# Altium project Glowna_plytka.PrjPcb
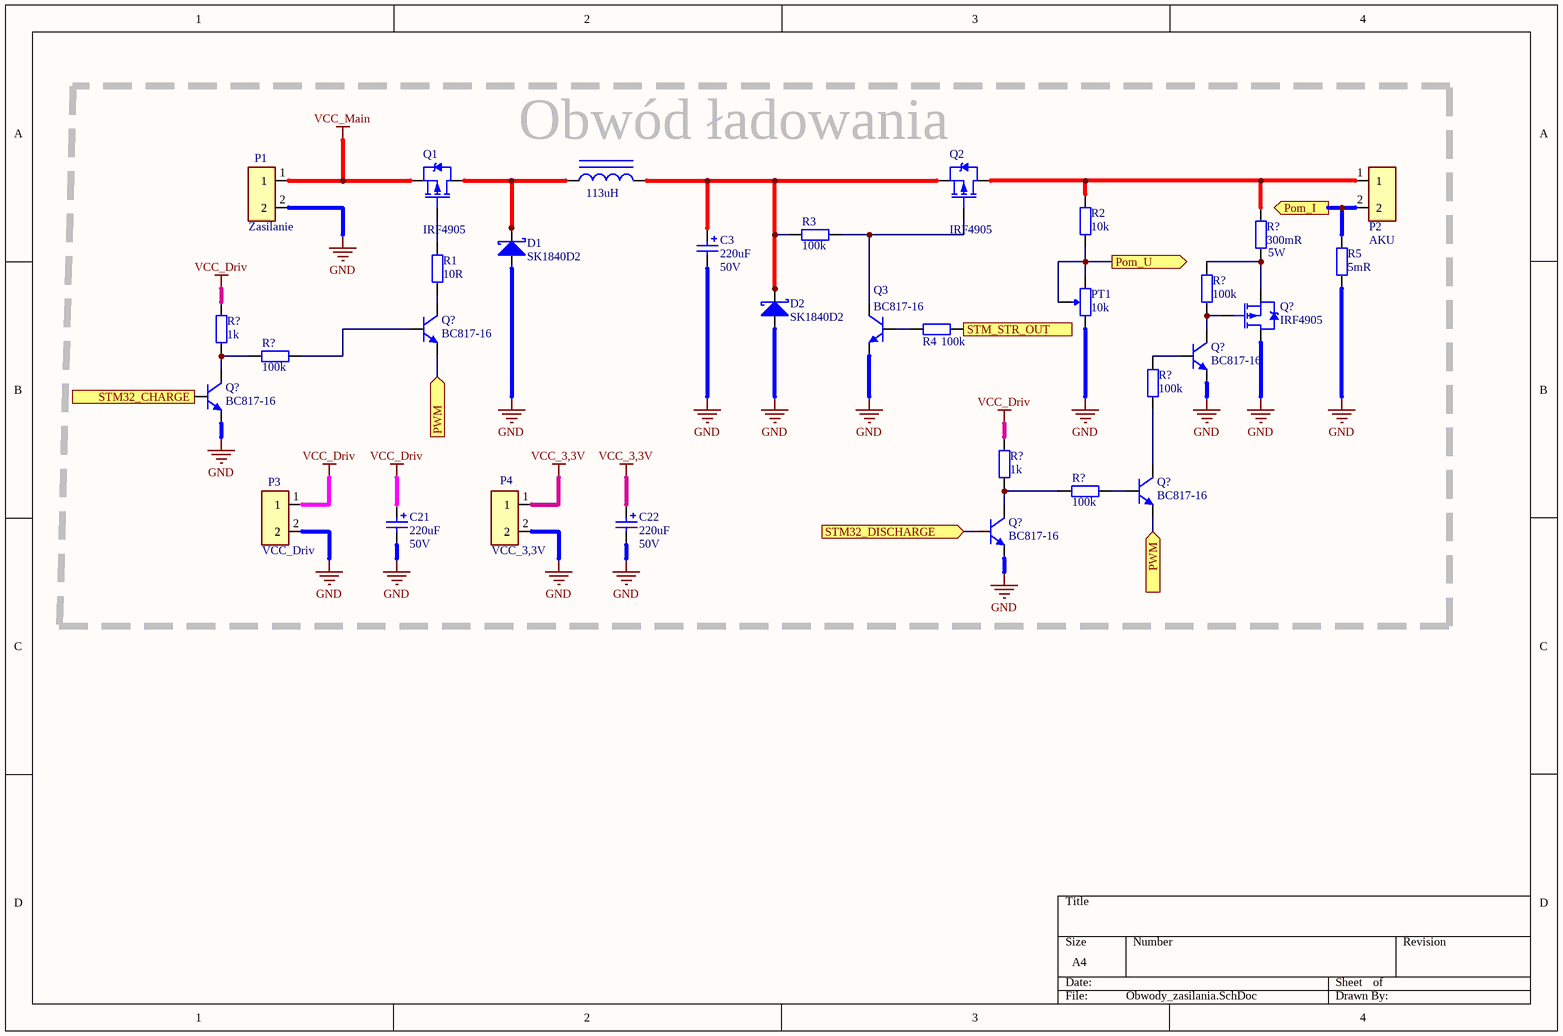
[diagram p0: Obwody_zasilania.SchDoc]
3 sheets, 82 parts. Net scope: flat (ports and power ports of the same name join across sheets).
Board file: Glowna_plytka.PcbDoc
Sheets:
  Obwody_zasilania.SchDoc
  Obwod_sterowania_MOSFET.SchDoc
  OBwod_sterowania_STM32.SchDoc

## Sheet Obwody_zasilania.SchDoc
size A4

### Parts
(Parts that share a designator on the sheet are numbered #1, #2 ... from top to bottom, then left to right.)
C3  Parametr_1: 220uF  Parametr_2: 50V  [C_POL_D10x16]  (hidden comment: Kondesator elektrolityczny)
C21  Parametr_1: 220uF  Parametr_2: 50V  [C_POL_D8x11,5]  (hidden comment: Kondesator elektrolityczny)
C22  Parametr_1: 220uF  Parametr_2: 50V  [C_POL_D10x16]  (hidden comment: Kondesator elektrolityczny)
D1  SK1840D2  [D2PAK]
D2  SK1840D2  [D2PAK]
L1  Parametr_1: 113uH  [L-EXX/XX/X]  (hidden comment: Inductor Iron)
P1  Oznaczenie: Zasilanie  [ARK2-5mm]  (hidden comment: Złacze śrubowe)
P2  Oznaczenie: AKU  [ARK2-5mm]  (hidden comment: Złacze śrubowe)
P3  Oznaczenie: VCC_Driv  [ARK2-5mm]  (hidden comment: Złacze śrubowe)
P4  Oznaczenie: VCC_3,3V  [ARK2-5mm]  (hidden comment: Złacze śrubowe)
PT1  Parametr_1: 10k  [Potecjomert]  (hidden comment: Potentiometer)
Q1  IRF4905  [D2PAK]
Q2  IRF4905  [D2PAK]
Q3  BC817-16  [SOT323]
Q?#1  BC817-16  [SOT323]
Q?#2  IRF4905  [D2PAK]
Q?#3  BC817-16  [SOT323]
Q?#4  BC817-16  [SOT323]
Q?#5  BC817-16  [SOT323]
Q?#6  BC817-16  [SOT323]
R1  Parametr_1: 10R  [SMD-1206-RES]  (hidden comment: Rezystor)
R2  Parametr_1: 10k  [SMD-1206-RES]  (hidden comment: Rezystor)
R3  Parametr_1: 100k  [SMD-1206-RES]  (hidden comment: Rezystor)
R4  Parametr_1: 100k  [SMD-1206-RES]  (hidden comment: Rezystor)
R5  Parametr_1: 5mR  [SMD-2512-RES]  (hidden comment: Rezystor)
R?#1  Parametr_2: 5W  Parametr_1: 300mR  [SMD-1206-RES]  (hidden comment: Rezystor)
R?#2  Parametr_1: 100k  [SMD-1206-RES]  (hidden comment: Rezystor)
R?#3  Parametr_1: 1k  [SMD-1206-RES]  (hidden comment: Rezystor)
R?#4  Parametr_1: 100k  [SMD-1206-RES]  (hidden comment: Rezystor)
R?#5  Parametr_1: 100k  [SMD-1206-RES]  (hidden comment: Rezystor)
R?#6  Parametr_1: 1k  [SMD-1206-RES]  (hidden comment: Rezystor)
R?#7  Parametr_1: 100k  [SMD-1206-RES]  (hidden comment: Rezystor)

### Blocks framed on the sheet
Obwód ładowania: C3 C21 C22 D1 D2 L1 P1-P4 PT1 Q1-Q3 Q?#1-Q?#6 R1-R5 R?#1-R?#7

### Ports
Pom_I (out), Pom_U (out), PWM (in), STM32_CHARGE (in), STM32_DISCHARGE (in), STM_STR_OUT (in)

### Nets
GND: C3.1 C21.1 C22.1 D1.3(A) D2.3(A) P1.2 P3.2 P4.2 PT1.3(BOT) Q3.2(E) Q?#2.2(D) Q?#3.2(E) Q?#4.2(E) Q?#6.2(E) R5.1
VCC_3,3V: C22.2 P4.1
VCC_Driv: C21.2 P3.1 R?#3.2 R?#6.2
VCC_Main: P1.1 Q1.3(S)
NetC3_2: C3.2 D2.1(K) D2.4(A) L1.5 Q2.3(S) R3.2
NetC23_2: P2.2 R5.2 ; port Pom_I
NetC24_2: PT1.1(TOP) PT1.2(TAP) R2.2 ; port Pom_U
NetD1_1: D1.1(K) D1.4(A) L1.1 Q1.2(D)
NetP2_1: P2.1 Q2.2(D) R2.1 R?#1.1
NetQ1_1: Q1.1(G) R1.2
NetQ2_1: Q2.1(G) Q3.3(C) R3.1
NetQ3_1: Q3.1(B) R4.2
NetQ?#1_1: Q?#1.1(B) R?#4.2
NetQ?#1_2: Q?#1.2(E) Q?#5.2(E) ; port PWM
NetQ?#1_3: Q?#1.3(C) R1.1
NetQ?#2_1: Q?#2.1(G) Q?#3.3(C) R?#2.2
NetQ?#2_3: Q?#2.3(S) R?#1.2 R?#2.1
NetQ?#3_1: Q?#3.1(B) R?#5.2
NetQ?#4_1: Q?#4.1(B) ; port STM32_CHARGE
NetQ?#4_3: Q?#4.3(C) R?#3.1 R?#4.1
NetQ?#5_1: Q?#5.1(B) R?#7.2
NetQ?#5_3: Q?#5.3(C) R?#5.1
NetQ?#6_1: Q?#6.1(B) ; port STM32_DISCHARGE
NetQ?#6_3: Q?#6.3(C) R?#6.1 R?#7.1
NetR4_1: R4.1 ; port STM_STR_OUT

### Library data of the parts
C3 C21 C22 = Kondesator elektrolityczny: Dostawca: TME; Montaż: THT; Obudowa: D10x16; Parametr_3: Tolerancja:; Parametr_4: Czas życzia:; Parametr_5: Temperatura pracy:; Nazwa: Kondesator elektrolityczny
  C3: Kod TME: ECA1EHG101
  C21 C22: Kod TME: JRG-220U/25
D1 D2 = SK1840D2: Dioda Schottky; Dostawca: TME; Montaż: SMD; Parametr_1: Prąd: 18A; Parametr_2: Max prąd imp.: 280A; Parametr_3: Max nap. wsteczne: 40V; Producent: DIOTEC SEMICONDUCTOR; Nazwa: Dioda Schottky; Obudowa: D2PAK; Oznaczenie: SK1840D2; Kod TME: SK1840D2-DIO
L1 = Inductor Iron: Magnetic-Core Inductor; Parametr_2: Ilość zwoji:; Parametr_3: Średnica drutu:; Revision: July-2002: Re-released for DXP Platform.
P1-P4 = Złacze śrubowe: Dostawca: TME; Montaż: THT; Nazwa: Listwa zaciskowa do druku, XY301V-2P; Parametr_1: 250VDC/AC; Parametr_2: 24A; Parametr_3: 2,5mm2; Producent: DEGSON ELECTRONICS; Kod TME: DG300-5.0-2P12
PT1 = Potentiometer: Potentiometer montażowy wielobortowy; Parametr_2: Moc:; Parametr_3: Tolerancja:; Parametr_4: Charakterystyka:; Parametr_5: Temperatura pracy:; Parametr_6: Max nap. pracy:; Nazwa: Potentiometer montażowy wielobortowy
Q1 Q2 Q?#2 = IRF4905: Traznystor MOSFET-P; Nazwa: Tranzystor MOSFET-P; Parametr_1: Prąd drenu: -74A; Parametr_2: Nap. dren-żródło: -55V; Parametr_3: Nap. bramka-żródło: -/+20V; Parametr_4: Rezystacja w stanie przewodzenia: 20mOhm; Parametr_6: Moc rozpraszana: 200W; Oznaczenie: IRF4905
Q3 Q?#1 Q?#3-Q?#6 = BC817-16: Tranzystor bipolarny PNP; Dostawca: TME; Montaż: SMD; Producent: DIOTEC SEMICONDUCTOR; Parametr_3: Npa. C-E: 45V; Parametr_4: Wzmocnienie: 100-250; Parametr_5: Częstotliwość: 100Mhz; Parametr_2: Prąd kolektora: 0,8A; Nazwa: Tranzystor bipolarny PNP; Obudowa: SOT323; Oznaczenie: BC817-16; Kod TME: BC817-16-DIO
R1-R4 R?#2-R?#7 = Rezystor: Dostawca: TME; Montaż: SMD; Obudowa: 1206; Parametr_2: Moc: 0,250W; Parametr_3: Tolerancja: 5%; Parametr_4: Max nap. pracy:; Parametr_5: Max nap impulsowe:; Nazwa: Rezystor
  R1: Kod TME: AC1206FR-0710RL
  R2-R4 R?#2-R?#7: Kod TME: SMD1206-100K
R5 = Rezystor: Dostawca: TME; Montaż: SMD; Obudowa: 2512; Parametr_2: Moc: 1W; Parametr_3: Tolerancja: 1%; Parametr_4: Max nap. pracy:; Parametr_5: Max nap impulsowe:; Nazwa: Rezystor; Kod TME: WW12RR005FTL
R?#1 = Rezystor: Dostawca: TME; Montaż: SMD; Obudowa: 1206; Parametr_3: Tolerancja: 5%; Parametr_4: Max nap. pracy:; Parametr_5: Max nap impulsowe:; Nazwa: Rezystor; Kod TME: SMD1206-100K

## Sheet Obwod_sterowania_MOSFET.SchDoc
size A4
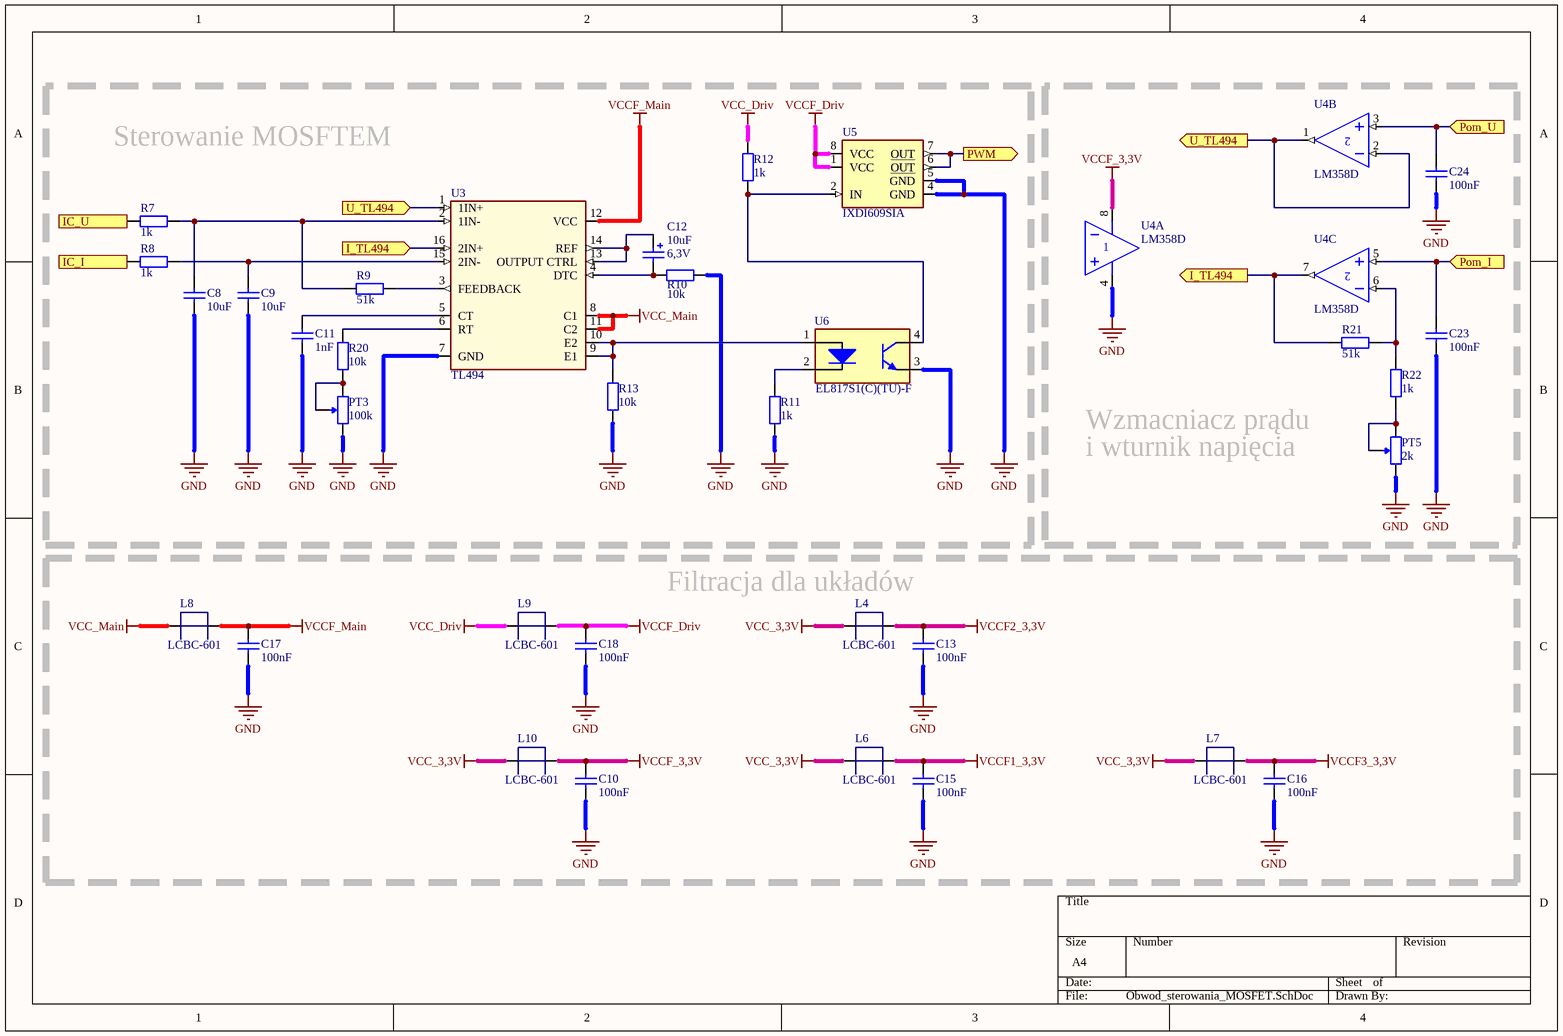
[diagram p1: Obwod_sterowania_MOSFET.SchDoc]

### Parts
C8  Parametr_1: 10uF  [SMD-1206C]  (hidden comment: Kondesator)
C9  Parametr_1: 10uF  [SMD-1206C]  (hidden comment: Kondesator)
C10  Parametr_1: 100nF  [SMD-1206C]  (hidden comment: Kondesator)
C11  Parametr_1: 1nF  [SMD-1206C]  (hidden comment: Kondesator)
C12  Parametr_1: 10uF  Parametr_2: 6,3V  [SMD-1206C]  (hidden comment: Kondesator elektrolityczny)
C13  Parametr_1: 100nF  [SMD-1206C]  (hidden comment: Kondesator)
C15  Parametr_1: 100nF  [SMD-1206C]  (hidden comment: Kondesator)
C16  Parametr_1: 100nF  [SMD-1206C]  (hidden comment: Kondesator)
C17  Parametr_1: 100nF  [SMD-1206C]  (hidden comment: Kondesator)
C18  Parametr_1: 100nF  [SMD-1206C]  (hidden comment: Kondesator)
C23  Parametr_1: 100nF  [SMD-1206C]  (hidden comment: Kondesator)
C24  Parametr_1: 100nF  [SMD-1206C]  (hidden comment: Kondesator)
L4  Oznaczenie: LCBC-601  [SMD-1206-RES]
L6  Oznaczenie: LCBC-601  [SMD-1206-RES]
L7  Oznaczenie: LCBC-601  [SMD-1206-RES]
L8  Oznaczenie: LCBC-601  [SMD-1206-RES]
L9  Oznaczenie: LCBC-601  [SMD-1206-RES]
L10  Oznaczenie: LCBC-601  [SMD-1206-RES]
PT3  Parametr_1: 100k  [Potecjomert]  (hidden comment: Potentiometer)
PT5  Parametr_1: 2k  [Potecjomert]  (hidden comment: Potentiometer)
R7  Parametr_1: 1k  [SMD-1206-RES]  (hidden comment: Rezystor)
R8  Parametr_1: 1k  [SMD-1206-RES]  (hidden comment: Rezystor)
R9  Parametr_1: 51k  [SMD-1206-RES]  (hidden comment: Rezystor)
R10  Parametr_1: 10k  [SMD-1206-RES]  (hidden comment: Rezystor)
R11  Parametr_1: 1k  [SMD-1206-RES]  (hidden comment: Rezystor)
R12  Parametr_1: 1k  [SMD-1206-RES]  (hidden comment: Rezystor)
R13  Parametr_1: 10k  [SMD-1206-RES]  (hidden comment: Rezystor)
R20  Parametr_1: 10k  [SMD-1206-RES]  (hidden comment: Rezystor)
R21  Parametr_1: 51k  [SMD-1206-RES]  (hidden comment: Rezystor)
R22  Parametr_1: 1k  [SMD-1206-RES]  (hidden comment: Rezystor)
U3  TL494  [SOP16]
U4  LM358D  [SOIC8]  (parts A,B,C of 3)
U5  IXDI609SIA  [SO8]
U6  Transoptor  [S1]  (value not drawn)

### Blocks framed on the sheet
Sterowanie MOSFTEM: C8 C9 C11 C12 PT3 R7-R13 R20 U3 U5 U6

### Ports
I_TL494 (in), I_TL494 (out), IC_I (in), IC_U (in), Pom_I (in), Pom_U (in), PWM (out), U_TL494 (in), U_TL494 (out)

### Nets
GND: C8.1 C9.1 C10.1 C11.1 C13.1 C15.1 C16.1 C17.1 C18.1 C23.1 C24.1 PT3.3(BOT) PT5.3(BOT) R10.2 R11.1 R13.1 U3.7(GND) U4.4(V-) U5.4(GND) U5.5(GND) U6.3
VCC_3,3V: L4.1 L6.1 L7.1 L10.1
VCC_Driv: L9.1 R12.2
VCC_Main: L8.1 U3.8(C1) U3.11(C2)
VCCF1_3,3V: C15.2 L6.2
VCCF2_3,3V: C13.2 L4.2
VCCF3_3,3V: C16.2 L7.2
VCCF_3,3V: C10.2 L10.2 U4.8(V+)
VCCF_Driv: C18.2 L9.2 U5.1(VCC) U5.8(VCC)
VCCF_Main: C17.2 L8.2 U3.12(VCC)
NetC8_2: C8.2 R7.2 R9.2 U3.2(1IN-)
NetC9_2: C9.2 R8.2 U3.15(2IN-)
NetC11_2: C11.2 U3.5(CT)
NetC12_1: C12.1 R10.1 U3.4(DTC)
NetC12_2: C12.2 U3.13(OUTPUT_CTRL) U3.14(REF)
NetC23_2: C23.2 U4.5(IN+) ; port Pom_I
NetC24_2: C24.2 U4.3(IN+) ; port Pom_U
NetPT3_1: PT3.1(TOP) PT3.2(TAP) R20.2
NetPT5_1: PT5.1(TOP) PT5.2(TAP) R22.2
NetQ?#1_2: U5.6(OUT) U5.7(OUT) ; port PWM
NetR7_1: R7.1 ; port IC_U
NetR8_1: R8.1 ; port IC_I
NetR9_1: R9.1 U3.3(FEEDBACK)
NetR11_2: R11.2 U6.2
NetR12_1: R12.1 U5.2(IN) U6.4
NetR13_2: R13.2 U3.9(E1) U3.10(E2) U6.1
NetR20_1: R20.1 U3.6(RT)
NetR21_1: R21.1 R22.1 U4.6(IN-)
NetR21_2: R21.2 U3.16(2IN+) U4.7(OUT) ; port I_TL494
NetU1_6: U3.1(1IN+) U4.1(OUT) U4.2(IN-) ; port U_TL494

### Notes on the sheet
- Wzmacniacz prądu
- (near PT5) i wturnik napięcia
- Filtracja dla układów

### Library data of the parts
C8-C11 C13 C15-C18 C23 C24 = Kondesator: Dostawca: TME; Montaż: SMD; Obudowa: 1206; Parametr_2: Napięcie:; Parametr_3: Tolerancja:; Parametr_4: Temperatura pracy:; Nazwa: Kondesator
  C8 C9: Kod TME: CL31A106KAHNNNE
  C10 C13 C15-C18: Kod TME: 1206B104K500CT
  C11 C23 C24: Kod TME: CL31B102KBCNNNC
C12 = Kondesator elektrolityczny: Dostawca: TME; Parametr_3: Tolerancja:; Parametr_4: Czas życzia:; Parametr_5: Temperatura pracy:; Nazwa: Kondesator elektrolityczny
L4 L6-L10 = Filtr: Montaż: SMD; Obudowa: 1206; Kod TME: LCBC-601; Nazwa: Filtr
PT3 PT5 = Potentiometer: as PT1 on sheet Obwody_zasilania; Nazwa: Potentiometer montażowy wielobortowy
R7-R13 R20-R22 = Rezystor: Parametr_2: Moc:; Parametr_3: Tolerancja:; Parametr_4: Max nap. pracy:; Parametr_5: Max nap impulsowe:; Nazwa: Rezystor
  R7 R8: Kod TME: CRCW12061K00JNTABC
  R9-R13 R20-R22: Kod TME: SMD1206-51K
U3 = TL494: DC/DC switcher, kontroler PWM; Parametr_1: Prąd wyjściowy: 0,25A; Parametr_2: Częstotliwość: 300kHz; Parametr_3: Liczba kanałów: 2; Parametr_4: Temperatura pracy: 0-70C; Parametr_5: Napięcie pracy: 7-40V; Nazwa: DC/DC switcher, kontroler PWM; Oznaczenie: TL494
U4 = LM358D: Wzmacniacz operacyjny; Parametr_1: Pasmo przenoszenia: 1,1MHz; Parametr_2: Liczba kanałów: 2; Parametr_3: Szybkość narastania nap.:  0,6V/us; Parametr_4: Teperatura pracy: 0-70C; Parametr_5: Npa. zasilania: 3-30V; Nazwa: Wzmacniacz operacyjny; Oznaczenie: LM358D
U5 = IXDI609SIA: driver MOSFET; Dostawca: TME; Montaż: SMD; Parametr_1: Prad: -9-9A; Parametr_2: Nap. zasilania: 4,5-35V; Parametr_3: 1 kanał odwracajcy; Producent: IXYS; Nazwa: driver MOSFET; Obudowa: SO8; Kod_TME: IXDI609SIA; Oznaczenie: IXDI609SIA
U6 = EL817S1(C)(TU)-F: Kondesator elektrolityczny; Nazwa: Tranzoptor; Kod TME: EL817S1-C-TU-F; Oznaczenie: EL817S1(C)(TU)-F

## Sheet OBwod_sterowania_STM32.SchDoc
size A4
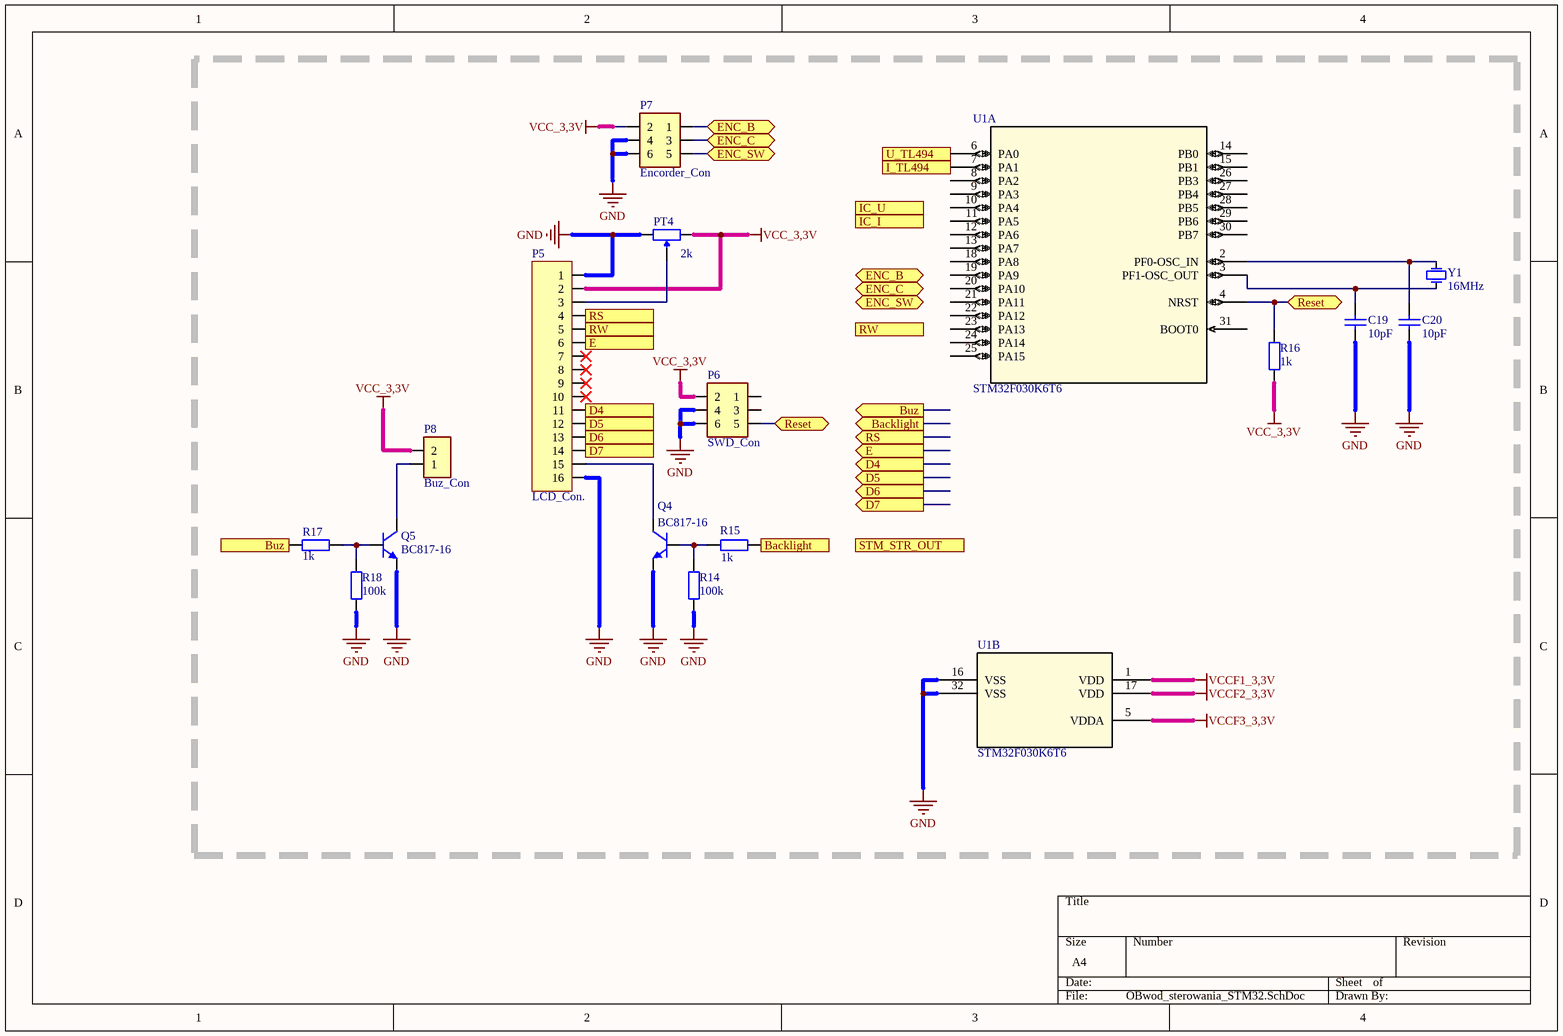
[diagram p2: OBwod_sterowania_STM32.SchDoc]

### Parts
C19  Parametr_1: 10pF  [SMD-1206C]  (hidden comment: Kondesator)
C20  Parametr_1: 10pF  [SMD-1206C]  (hidden comment: Kondesator)
P5  LCD_Con.  [Header_Male 1x16]
P6  SWD_Con  [goldpin SMD 1,27]
P7  Encorder_Con  [Header_Male 2X3]
P8  Buz_Con  [Header_Male 1x2]
PT4  Parametr_1: 2k  [Potecjomert]  (hidden comment: Potentiometer)
Q4  BC817-16  [SOT323]
Q5  BC817-16  [SOT323]
R14  Parametr_1: 100k  [SMD-1206-RES]  (hidden comment: Rezystor)
R15  Parametr_1: 1k  [SMD-1206-RES]  (hidden comment: Rezystor)
R16  Parametr_1: 1k  [SMD-1206-RES]  (hidden comment: Rezystor)
R17  Parametr_1: 1k  [SMD-1206-RES]  (hidden comment: Rezystor)
R18  Parametr_1: 100k  [SMD-1206-RES]  (hidden comment: Rezystor)
U1  STM32F030K6T6  [LQFP-32]  (parts A,B of 2)
Y1  16MHz  [HC49SM]

### Ports
Backlight (in), Backlight (out), Buz (in), Buz (out), D4 (in), D4 (out), D5 (in), D5 (out), D6 (in), D6 (out), D7 (in), D7 (out), E (in), E (out), ENC_B (bidir), ENC_C (bidir), ENC_SW (bidir), I_TL494 (in), IC_I (out), IC_U (out), Reset (bidir), RS (in), RS (out), RW (in), RW (out), STM_STR_OUT (out), U_TL494 (in)

### Nets
GND: C19.2 C20.1 P5.1 P5.16 P6.4 P6.6 P7.4 P7.6 PT4.1(TOP) Q4.2(E) Q5.2(E) R14.2 R18.2 U1.16(VSS) U1.32(VSS)
VCC_3,3V: P5.2 P6.2 P7.2 P8.2 PT4.3(BOT) R16.1
VCCF1_3,3V: U1.1(VDD)
VCCF2_3,3V: U1.17(VDD)
VCCF3_3,3V: U1.5(VDDA)
NetC19_1: C19.1 U1.3(PF1-OSC_OUT) Y1.1(OSC1)
NetC20_2: C20.2 U1.2(PF0-OSC_IN) Y1.2(OSC2)
NetP5_3: P5.3 PT4.2(TAP)
NetP5_4: P5.4 ; port RS
NetP5_5: P5.5 ; port RW
NetP5_6: P5.6 ; port E
NetP5_11: P5.11 ; port D4
NetP5_12: P5.12 ; port D5
NetP5_13: P5.13 ; port D6
NetP5_14: P5.14 ; port D7
NetP5_15: P5.15 Q4.3(C)
NetP6_5: P6.5 R16.2 U1.4(NRST) ; port Reset
NetP7_1: P7.1 ; port ENC_B
NetP7_3: P7.3 ; port ENC_C
NetP7_5: P7.5 ; port ENC_SW
NetP8_1: P8.1 Q5.3(C)
NetQ4_1: Q4.1(B) R14.1 R15.2
NetQ5_1: Q5.1(B) R17.2 R18.1
NetR15_1: R15.1 ; port Backlight
NetR17_1: R17.1 ; port Buz
NetR21_2: U1.7(PA1) ; port I_TL494
NetU1_6: U1.6(PA0) ; port U_TL494

Not connected (* = marked no-connect by the designer): P5 7* 8* 9* 10*; P6 1 3; U1 8(PA2) 9(PA3) 10(PA4) 11(PA5) 12(PA6) 13(PA7) 14(PB0) 15(PB1) 18(PA8) 19(PA9) 20(PA10) 21(PA11) 22(PA12) 23(PA13) 24(PA14) 25(PA15) 26(PB3) 27(PB4) 28(PB5) 29(PB6) 30(PB7) 31(BOOT0)

### Library data of the parts
C19 C20 = Kondesator: as C8 on sheet Obwod_sterowania_MOSFET; Nazwa: Kondesator; Kod TME: 1206B104K500CT
P5 = Header 16: Header, 16-Pin; LatestRevisionDate: 17-Jul-2002; LatestRevisionNote: Re-released for DXP Platform.; Publisher: Altium Limited
P6 P7 = Header 2x3: Nazwa: Header 2x3
P8 = Header 2: LatestRevisionDate: 17-Jul-2002; LatestRevisionNote: Re-released for DXP Platform.; Publisher: Altium Limited
PT4 = Potentiometer: as PT1 on sheet Obwody_zasilania; Nazwa: Potentiometer montażowy wielobortowy
Q4 Q5 = BC817-16: as Q3 on sheet Obwody_zasilania; Nazwa: Tranzystor bipolarny PNP; Obudowa: SOT323; Oznaczenie: BC817-16; Kod TME: BC817-16-DIO
R14-R18 = Rezystor: as R1 on sheet Obwody_zasilania; Nazwa: Rezystor; Kod TME: SMD1206-100K
U1 = STM32F030K6T6: No Description Available; Mfr_Name: STMicroelectronics; Copyright: Copyright (C) 2022 Ultra Librarian. All rights reserved.; Manufacturer_Part_Number: STM32F030K6T6; RefDes: RefDes; Type: DEV
Y1 = Oscylator

## Nets that join several sheets
GND: Obwody_zasilania (15 pins), Obwod_sterowania_MOSFET (21 pins), OBwod_sterowania_STM32 (15 pins)
VCC_3,3V: Obwody_zasilania (C22.2 P4.1), Obwod_sterowania_MOSFET (L4.1 L6.1 L7.1 L10.1), OBwod_sterowania_STM32 (6 pins)
VCC_Driv: Obwody_zasilania (C21.2 P3.1 R?#3.2 R?#6.2), Obwod_sterowania_MOSFET (L9.1 R12.2)
VCC_Main: Obwody_zasilania (P1.1 Q1.3), Obwod_sterowania_MOSFET (L8.1 U3.8 U3.11)
VCCF1_3,3V: Obwod_sterowania_MOSFET (C15.2 L6.2), OBwod_sterowania_STM32 (U1.1)
VCCF2_3,3V: Obwod_sterowania_MOSFET (C13.2 L4.2), OBwod_sterowania_STM32 (U1.17)
VCCF3_3,3V: Obwod_sterowania_MOSFET (C16.2 L7.2), OBwod_sterowania_STM32 (U1.5)
NetC23_2: Obwody_zasilania (P2.2 R5.2), Obwod_sterowania_MOSFET (C23.2 U4.5)
NetC24_2: Obwody_zasilania (PT1.1 PT1.2 R2.2), Obwod_sterowania_MOSFET (C24.2 U4.3)
NetQ?#1_2: Obwody_zasilania (Q?#1.2 Q?#5.2), Obwod_sterowania_MOSFET (U5.6 U5.7)
NetR21_2: Obwod_sterowania_MOSFET (R21.2 U3.16 U4.7), OBwod_sterowania_STM32 (U1.7)
NetU1_6: Obwod_sterowania_MOSFET (U3.1 U4.1 U4.2), OBwod_sterowania_STM32 (U1.6)